# Altium schematic sheet ai.SchDoc
size A1
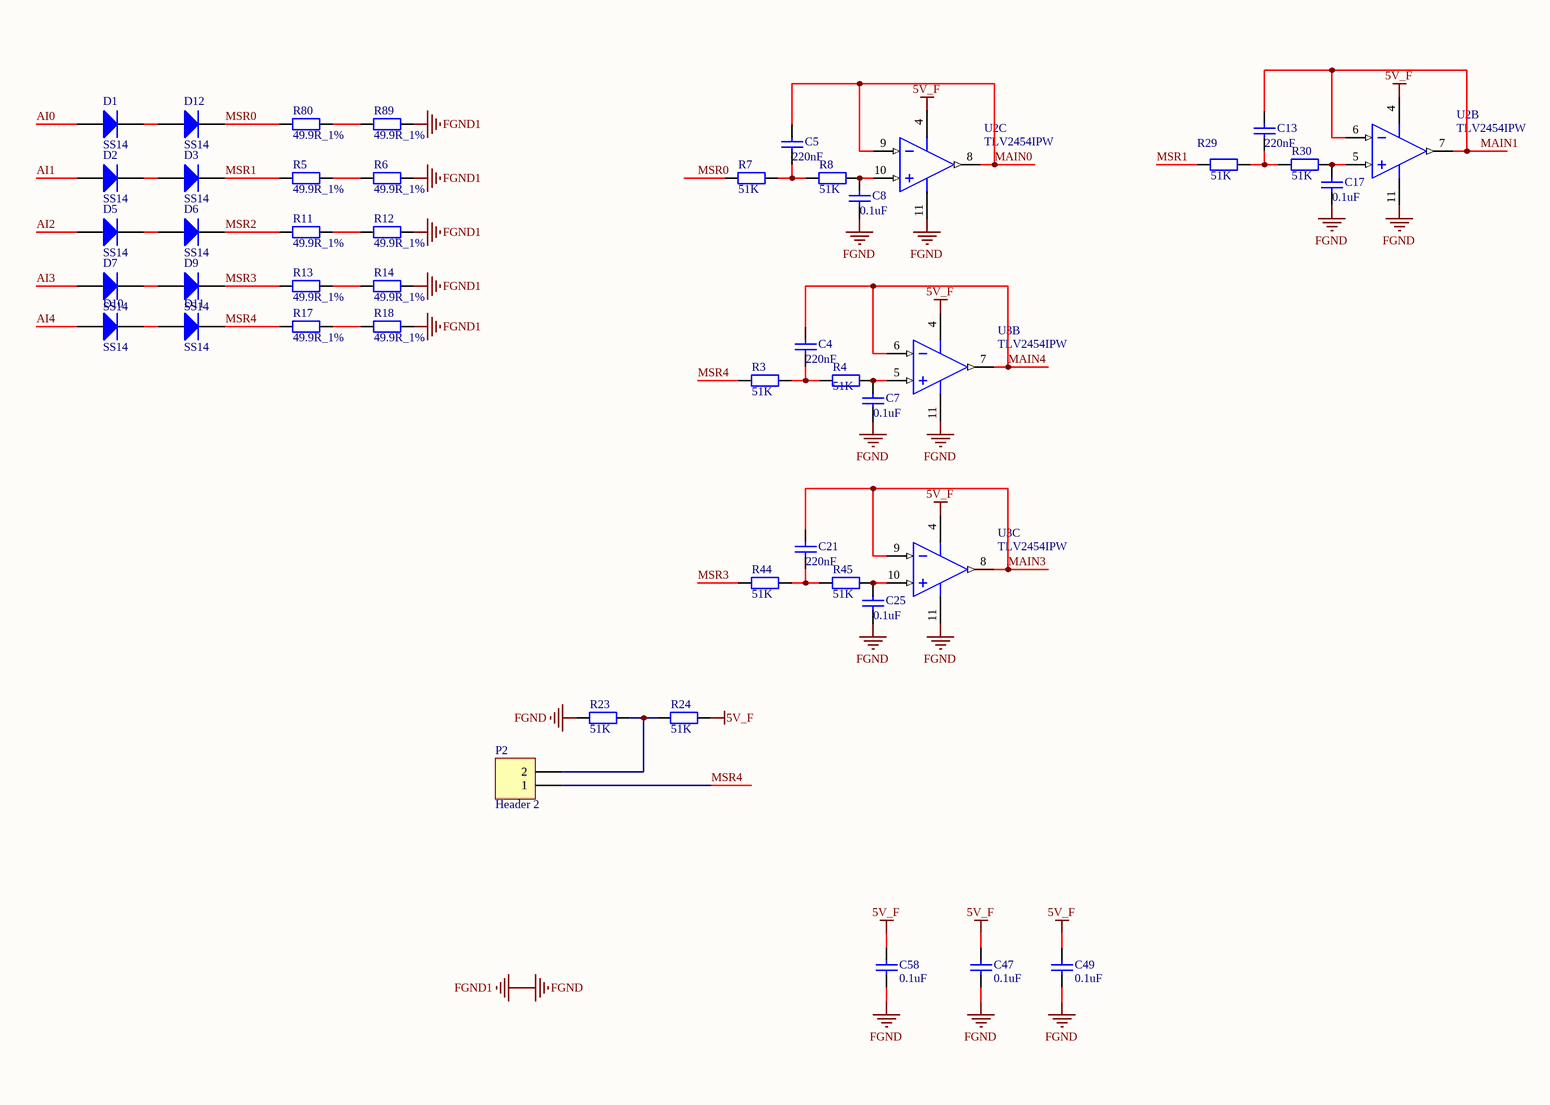
[diagram p0: ai.SchDoc, top left]
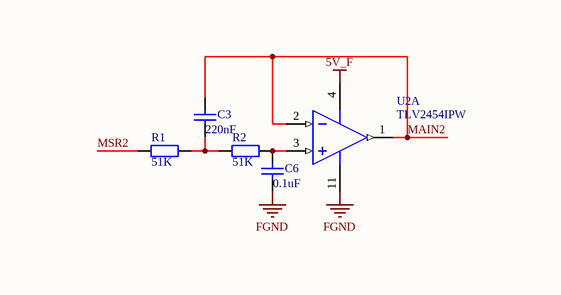
[diagram p1: ai.SchDoc, top right]
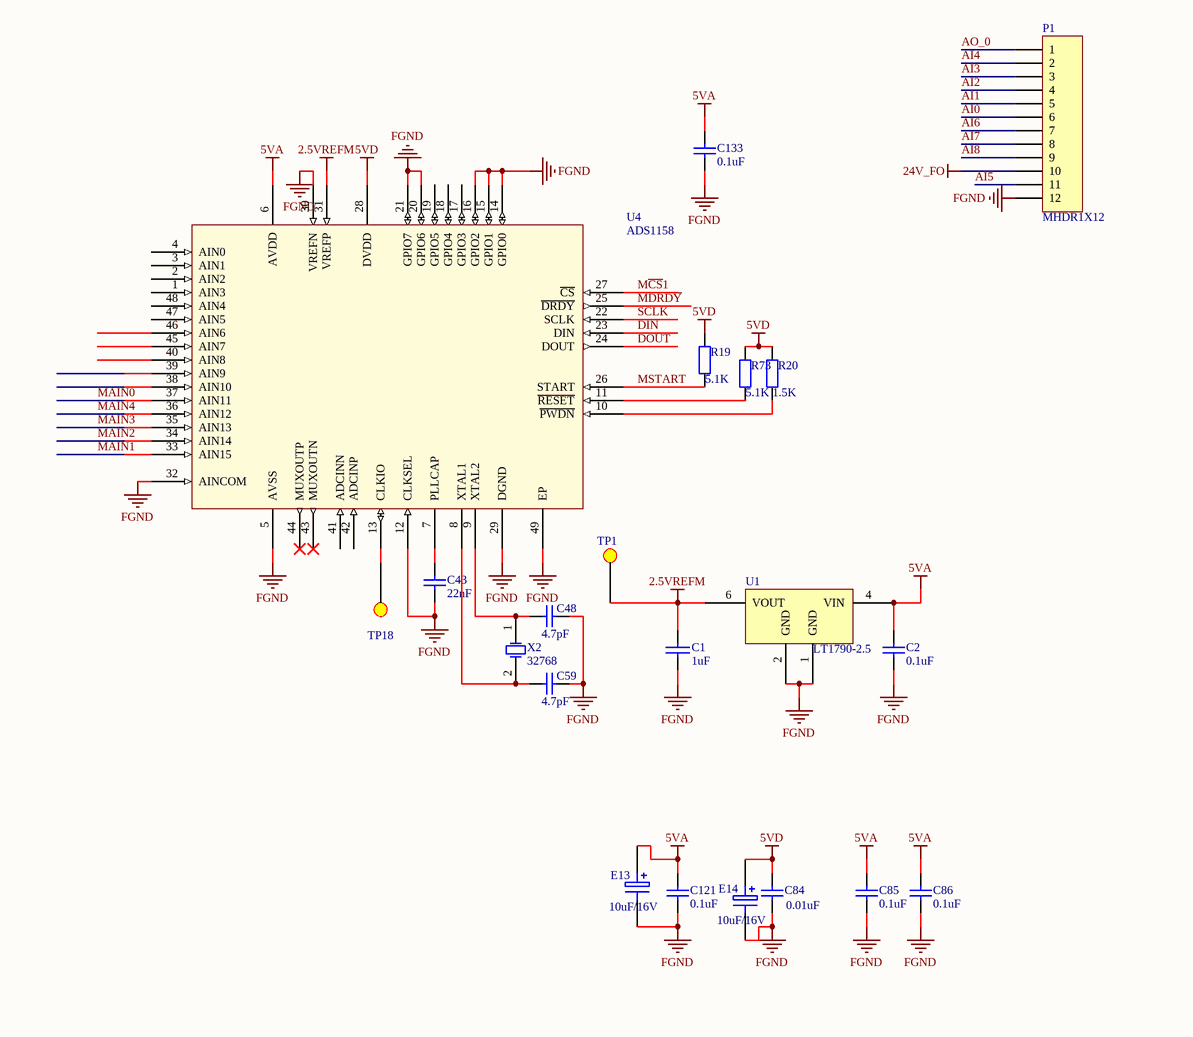
[diagram p2: ai.SchDoc, bottom left]
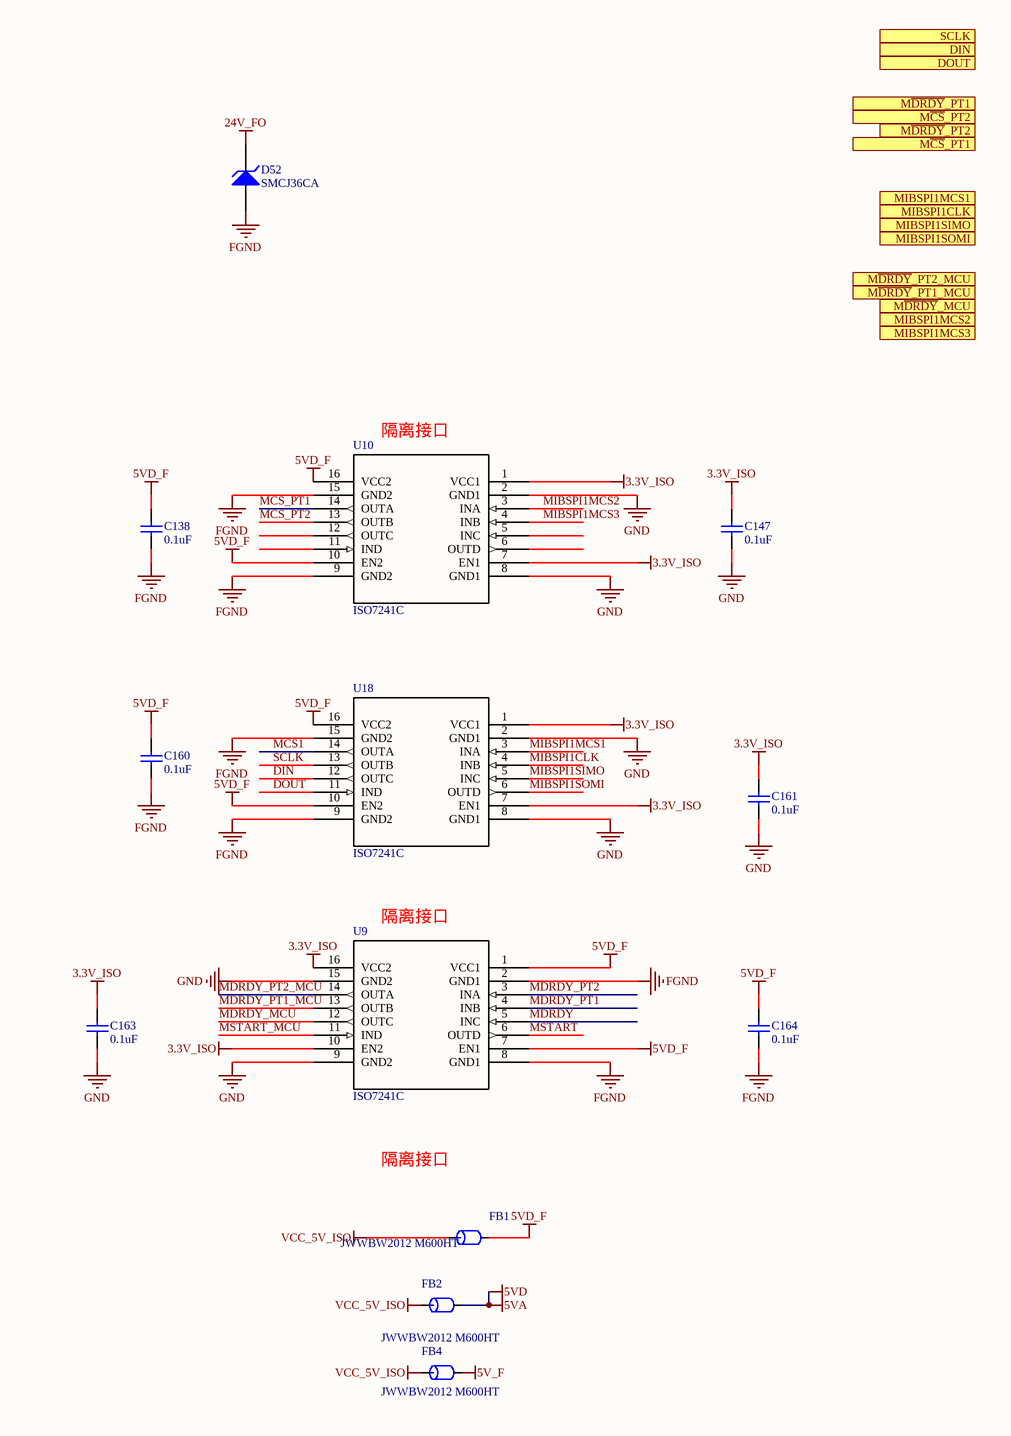
[diagram p3: ai.SchDoc, bottom right]

## Parts
C1  1uF  [0603C]
C2  0.1uF  [0603C]
C3  220nF  [0805C]
C4  220nF  [0805C]
C5  220nF  [0805C]
C6  0.1uF  [0603C]
C7  0.1uF  [0603C]
C8  0.1uF  [0603C]
C13  220nF  [0805C]
C17  0.1uF  [0603C]
C21  220nF  [0805C]
C25  0.1uF  [0603C]
C43  22nF  [0805C]
C47  0.1uF  [0603C]
C48  4.7pF  [0603C]
C49  0.1uF  [0603C]
C58  0.1uF  [0603C]
C59  4.7pF  [0603C]
C84  0.01uF  [0603C]
C85  0.1uF  [0603C]
C86  0.1uF  [0603C]
C121  0.1uF  [0603C]
C133  0.1uF  [0603C]
C138  0.1uF  [0603C]
C147  0.1uF  [0603C]
C160  0.1uF  [0603C]
C161  0.1uF  [0603C]
C163  0.1uF  [0603C]
C164  0.1uF  [0603C]
D1  SS14  [DO-214AC]
D2  SS14  [DO-214AC]
D3  SS14  [DO-214AC]
D5  SS14  [DO-214AC]
D6  SS14  [DO-214AC]
D7  SS14  [DO-214AC]
D9  SS14  [DO-214AC]
D10  SS14  [DO-214AC]
D11  SS14  [DO-214AC]
D12  SS14  [DO-214AC]
D52  SMCJ36CA  [SMC]
E13  10uF/16V  [C3528]
E14  10uF/16V  [C3528]
FB1  JWWBW2012 M600HT  [0805R]
FB2  JWWBW2012 M600HT  [0805R]
FB4  JWWBW2012 M600HT  [0805R]
P1  MHDR1X12  [2ETYR-5.08-12P-14-100]
P2  Header 2  [HDR1X2]  (no BOM)
R1  51K  [0603R]
R2  51K  [0603R]
R3  51K  [0603R]
R4  51K  [0603R]
R5  49.9R_1%  [0805R]
R6  49.9R_1%  [0805R]
R7  51K  [0603R]
R8  51K  [0603R]
R11  49.9R_1%  [0805R]
R12  49.9R_1%  [0805R]
R13  49.9R_1%  [0805R]
R14  49.9R_1%  [0805R]
R17  49.9R_1%  [0805R]
R18  49.9R_1%  [0805R]
R19  5.1K  [0603R]
R20  1.5K  [0603R]
R23  51K  [0603R]
R24  51K  [0603R]
R29  51K  [0603R]
R30  51K  [0603R]
R44  51K  [0603R]
R45  51K  [0603R]
R73  5.1K  [0603R]
R80  49.9R_1%  [0805R]
R89  49.9R_1%  [0805R]
TP1  TEST_POINT  [TPD]  (value not drawn)
TP18  TEST_POINT  [TPD]  (value not drawn)
U1  LT1790-2.5  [SOT23-6]
U2  TLV2454IPW  [TSSOP14]  (parts A,B,C of 4)
U3  TLV2454IPW  [TSSOP14]  (parts B,C of 4)
U4  ADS1158  [S-PVFQN-N48]
U9  ISO7241C  [SOIC16]
U10  ISO7241C  [SOIC16]
U18  ISO7241C  [SOIC16]
X2  32768  [A]

## Ports
DIN (in), DOUT (out), MIBSPI1CLK (in), MIBSPI1MCS1 (in), MIBSPI1MCS2 (in), MIBSPI1MCS3 (in), MIBSPI1SIMO (in), MIBSPI1SOMI (out), M~{CS}_PT1 (out), M~{CS}_PT2 (out), M~{DRDY}_MCU (out), M~{DRDY}_PT1 (out), M~{DRDY}_PT1_MCU (out), M~{DRDY}_PT2 (out), M~{DRDY}_PT2_MCU (out), SCLK (in)

## Nets
2.5VREFM: C1.1 TP1.1 U1.6(VOUT) U4.31(VREFP)
3.3V_ISO: C147.2 C161.2 C163.2 U9.10(EN2) U9.16(VCC2) U10.1(VCC1) U10.7(EN1) U18.1(VCC1) U18.7(EN1)
5V_F: C47.2 C49.2 C58.2 FB4.2 R24.2 U2.4(V+) U3.4(V+)
5VA: C2.2 C84.2 C85.2 C86.2 C121.2 C133.2 E13.1 E14.1 FB2.2 R19.1 R20.1 R73.1 U1.4(VIN) U4.6(AVDD) U4.28(DVDD)  [also labelled 5VD]
5VD_F: C138.2 C160.2 C164.2 FB1.2 U9.1(VCC1) U9.7(EN1) U10.10(EN2) U10.16(VCC2) U18.10(EN2) U18.16(VCC2)
24V_FO: D52.2(K) P1.10
FGND: C1.2 C2.1 C6.1 C7.1 C8.1 C17.1 C25.1 C43.2 C47.1 C48.2 C49.1 C58.1 C59.2 C84.1 C85.1 C86.1 C121.1 C133.1 C138.1 C160.1 C164.1 D52.1(A) E13.2 E14.2 P1.12 R6.1 R12.1 R14.1 R18.1 R23.1 R89.1 U1.1(GND) U1.2(GND) U2.11(GND) U3.11(GND) U4.5(AVSS) U4.12(CLKSEL) U4.14(GPIO0) U4.15(GPIO1) U4.16(GPIO2) U4.20(GPIO6) U4.21(GPIO7) U4.29(DGND) U4.30(VREFN) U4.32(AINCOM) U4.49(EP) U9.2(GND1) U9.8(GND1) U10.9(GND2) U10.15(GND2) U18.9(GND2) U18.15(GND2)  [also labelled FGND1]
GND: C147.1 C161.1 C163.1 U9.9(GND2) U9.15(GND2) U10.2(GND1) U10.8(GND1) U18.2(GND1) U18.8(GND1)
VCC_5V_ISO: FB1.1 FB2.1 FB4.1
AI0: D1.1(A) P1.6
AI1: D2.1(A) P1.5
AI2: D5.1(A) P1.4
AI3: D7.1(A) P1.3
AI4: D10.1(A) P1.2
AI5: P1.11
AI6: P1.7
AI7: P1.8
AI8: P1.9
AO_0: P1.1
DIN: U4.23(DIN) U18.12(OUTC)
DOUT: U4.24(DOUT) U18.11(IND)
MAIN0: C5.2 U2.8(OUT) U2.9(IN-) U4.37(AIN11)
MAIN1: C13.2 U2.6(IN-) U2.7(OUT) U4.33(AIN15)
MAIN2: C3.2 U2.1(OUT) U2.2(IN-) U4.34(AIN14)
MAIN3: C21.2 U3.8(OUT) U3.9(IN-) U4.35(AIN13)
MAIN4: C4.2 U3.6(IN-) U3.7(OUT) U4.36(AIN12)
M~{CS}1: U4.27(~{CS}) U18.14(OUTA)
M~{CS}_PT1: U10.14(OUTA)
M~{CS}_PT2: U10.13(OUTB)
M~{DRDY}: U4.25(~{DRDY}) U9.5(INC)
M~{DRDY}_MCU: U9.12(OUTC)
M~{DRDY}_PT1: U9.4(INB)
M~{DRDY}_PT1_MCU: U9.13(OUTB)
M~{DRDY}_PT2: U9.3(INA)
M~{DRDY}_PT2_MCU: U9.14(OUTA)
MIBSPI1CLK: U18.4(INB)
MIBSPI1MCS1: U18.3(INA)
MIBSPI1MCS2: U10.3(INA)
MIBSPI1MCS3: U10.4(INB)
MIBSPI1SIMO: U18.5(INC)
MIBSPI1SOMI: U18.6(OUTD)
MSR0: D12.2(K) R7.2 R80.2
MSR1: D3.2(K) R5.2 R29.2
MSR2: D6.2(K) R1.2 R11.2
MSR3: D9.2(K) R13.2 R44.2
MSR4: D11.2(K) P2.1 R3.2 R17.2
MSTART: R19.2 U4.26(START) U9.6(OUTD)
MSTART_MCU: U9.11(IND)
SCLK: U4.22(SCLK) U18.13(OUTB)
NetC3_1: C3.1 R1.1 R2.2
NetC4_1: C4.1 R3.1 R4.2
NetC5_1: C5.1 R7.1 R8.2
NetC6_2: C6.2 R2.1 U2.3(IN+)
NetC7_2: C7.2 R4.1 U3.5(IN+)
NetC8_2: C8.2 R8.1 U2.10(IN+)
NetC13_1: C13.1 R29.1 R30.2
NetC17_2: C17.2 R30.1 U2.5(IN+)
NetC21_1: C21.1 R44.1 R45.2
NetC25_2: C25.2 R45.1 U3.10(IN+)
NetC43_1: C43.1 U4.7(PLLCAP)
NetC48_1: C48.1 U4.9(XTAL2) X2.1(OSC1)
NetC59_1: C59.1 U4.8(XTAL1) X2.2(OSC2)
NetD1_2: D1.2(K) D12.1(A)
NetD2_2: D2.2(K) D3.1(A)
NetD5_2: D5.2(K) D6.1(A)
NetD7_2: D7.2(K) D9.1(A)
NetD10_2: D10.2(K) D11.1(A)
NetP2_2: P2.2 R23.2 R24.1
NetR5_1: R5.1 R6.2
NetR11_1: R11.1 R12.2
NetR13_1: R13.1 R14.2
NetR17_1: R17.1 R18.2
NetR20_2: R20.2 U4.10(~{PWDN})
NetR73_2: R73.2 U4.11(~{RESET})
NetR80_1: R80.1 R89.2
NetTP18_1: TP18.1 U4.13(CLKIO)

Not connected (* = marked no-connect by the designer): U1 3(DNC) 5(DNC); U4 1(AIN3) 2(AIN2) 3(AIN1) 4(AIN0) 17(GPIO3) 18(GPIO4) 19(GPIO5) 38(AIN10) 39(AIN9) 40(AIN8) 41(ADCINN) 42(ADCINP) 43(MUXOUTN)* 44(MUXOUTP)* 45(AIN7) 46(AIN6) 47(AIN5) 48(AIN4); U10 5(INC) 6(OUTD) 11(IND) 12(OUTC)

## Notes on the sheet
- (near U10) 隔离接口
- (near U9) 隔离接口
- 隔离接口

## Library data of the parts
C1 = CAP: Capacitor
C2-C8 C13 C17 C21 C25 C43 C47-C49 C58 C84-C86 C121 C133 C138 C147 C160 C161 C163 C164 = Cap: Capacitor; Published: 8-Jun-2000; LatestRevisionDate: 17-Jul-2002; LatestRevisionNote: Re-released for DXP Platform.; PackageReference: RAD-0.3; Publisher: Altium Limited; PackageDescription: Radial Cap, Thru-Hole; 2 Leads; 0.3 in Pin Spacing
  C2 C47 C49 C58 C85 C86 C121 C133 C138 C147 C160 C161 C163 C164: Value: 0.1uF
C59 = Cap: Capacitor; Value: 6.8pF; Published: 8-Jun-2000; LatestRevisionDate: 17-Jul-2002; LatestRevisionNote: Re-released for DXP Platform.; PackageReference: RAD-0.3; Publisher: Altium Limited; PackageDescription: Radial Cap, Thru-Hole; 2 Leads; 0.3 in Pin Spacing
D1-D3 D5-D7 D9-D12 = Diode: Default Diode; Published: 8-Jun-2000; LatestRevisionDate: 17-Jul-2002; LatestRevisionNote: Re-released for DXP Platform.; PackageVersion: Sep-1996; PackageReference: SMC; Publisher: Altium Limited; Code_JEDEC: DO-214-AB
D52 = D Zener: SMBJ36CA; Published: 8-Jun-2000; LatestRevisionDate: 17-Jul-2002; LatestRevisionNote: Re-released for DXP Platform.; PackageReference: DIODE-0.7; Publisher: Altium Limited
E13 E14 = ELECTRO1: Electrolytic Capacitor
FB1 FB2 FB4 = FB: Part Field 1: 磁珠/0603/1K ohm/100MHz; FB: BLM18BD102SN1(muRata); Text Field1: FB
P1 = MHDR1X12: Header, 12-Pin; LatestRevisionDate: 17-Jul-2002; LatestRevisionNote: Re-released for DXP Platform.; Publisher: Altium Limited
P2 = Header 2: Header, 2-Pin; LatestRevisionDate: 17-Jul-2002; LatestRevisionNote: Re-released for DXP Platform.; Publisher: Altium Limited
R1-R8 R11-R14 R17-R20 R23 R24 R29 R30 R44 R45 R73 R80 R89 = Res0805M
U1 = LT1790-2.5: 2.5V Micropower SOT-23  Low Dropout Reference
U2 U3 = MAX908EPD: Quad High-speed, Ultra Low-power, Single-Supply TTL comparator; Published: 16-Jan-2001; LatestRevisionDate: 29-May-2009; LatestRevisionNote: Component Body Added.; DatasheetVersion: Jul-1994; PackageVersion: RevB, 21-0043; PackageReference: PD14; Publisher: Altium Limited; PackageDescription: DIP, 14-Pin, Row Spacing 7.62 mm, Pitch 2.54 mm; Code_JEDEC: MS-001-AC; ComponentLink1Description: Manufacturer Link; ComponentLink1URL: http://www.maxim-ic.com/; ComponentLink2Description: Datasheet; ComponentLink2URL: http://pdfserv.maxim-ic.com/en/ds/MAX907-MAX909.pdf
U4 = ADS1158: 16-Channel, 16-Bit Analog-to-Digital Converter
X2 = XTAL: Crystal Oscillator; Published: 8-Jun-2000; LatestRevisionDate: 17-Jul-2002; LatestRevisionNote: Re-released for DXP Platform.; PackageReference: R38; Publisher: Altium Limited